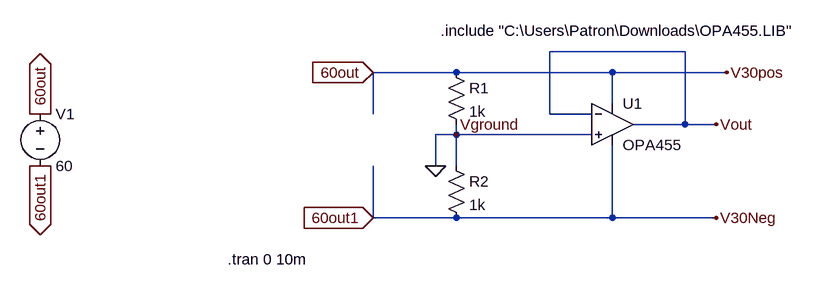
[diagram p0: schematic SP26_StimtheBrim_AmplifierCircuitSim_IsabelWilmot .asc]
SP26_StimtheBrim_AmplifierCircuitSim_IsabelWilmot .asc, the LTspice schematic file:
Version 4.1
SHEET 1 880 680
WIRE 368 80 160 80
WIRE 16 112 -112 112
WIRE 256 112 16 112
WIRE 432 112 256 112
WIRE 256 160 256 112
WIRE -112 176 -112 112
WIRE 160 176 160 80
WIRE 224 176 160 176
WIRE 368 192 368 80
WIRE 368 192 288 192
WIRE 416 192 368 192
WIRE 16 208 16 192
WIRE 16 208 -16 208
WIRE 224 208 16 208
WIRE -16 256 -16 208
WIRE 16 256 16 208
WIRE -112 336 -112 256
WIRE 16 336 -112 336
WIRE 256 336 256 224
WIRE 256 336 16 336
WIRE 416 336 256 336
FLAG 432 112 V30pos
FLAG 416 336 V30Neg
FLAG 416 192 Vout
FLAG -16 256 0
FLAG 16 208 Vground
FLAG -624 176 60out
IOPIN -624 176 Out
FLAG -624 256 60out1
IOPIN -624 256 Out
FLAG -112 112 60out
IOPIN -112 112 In
FLAG -112 336 60out1
IOPIN -112 336 In
SYMBOL OpAmps\\opamp2 256 128 R0
SYMATTR InstName U1
SYMATTR Value OPA455
SYMBOL res 0 96 R0
SYMATTR InstName R1
SYMATTR Value 1k
SYMBOL res 0 240 R0
SYMATTR InstName R2
SYMATTR Value 1k
SYMBOL voltage -624 160 R0
WINDOW 123 0 0 Left 0
WINDOW 39 0 0 Left 0
SYMATTR InstName V1
SYMATTR Value 60
TEXT -8 48 Left 2 !.include "C:\\Users\\Patron\\Downloads\\OPA455.LIB"
TEXT -336 400 Left 2 !.tran 0 10m

The netlist it stands for:
* SP26_StimtheBrim_AmplifierCircuitSim_IsabelWilmot .asc
X§U1 0 Vout 60out 60out1 Vout OPA455  ; pins In+ In- V+ V- OUT
R1 60out 0 1k
R2 0 60out1 1k
V1 60out 60out1 60
.include "C:\Users\Patron\Downloads\OPA455.LIB"
.tran 0 10m
.backanno
.end